# EAGLE design version1 (EAGLE 5.11)
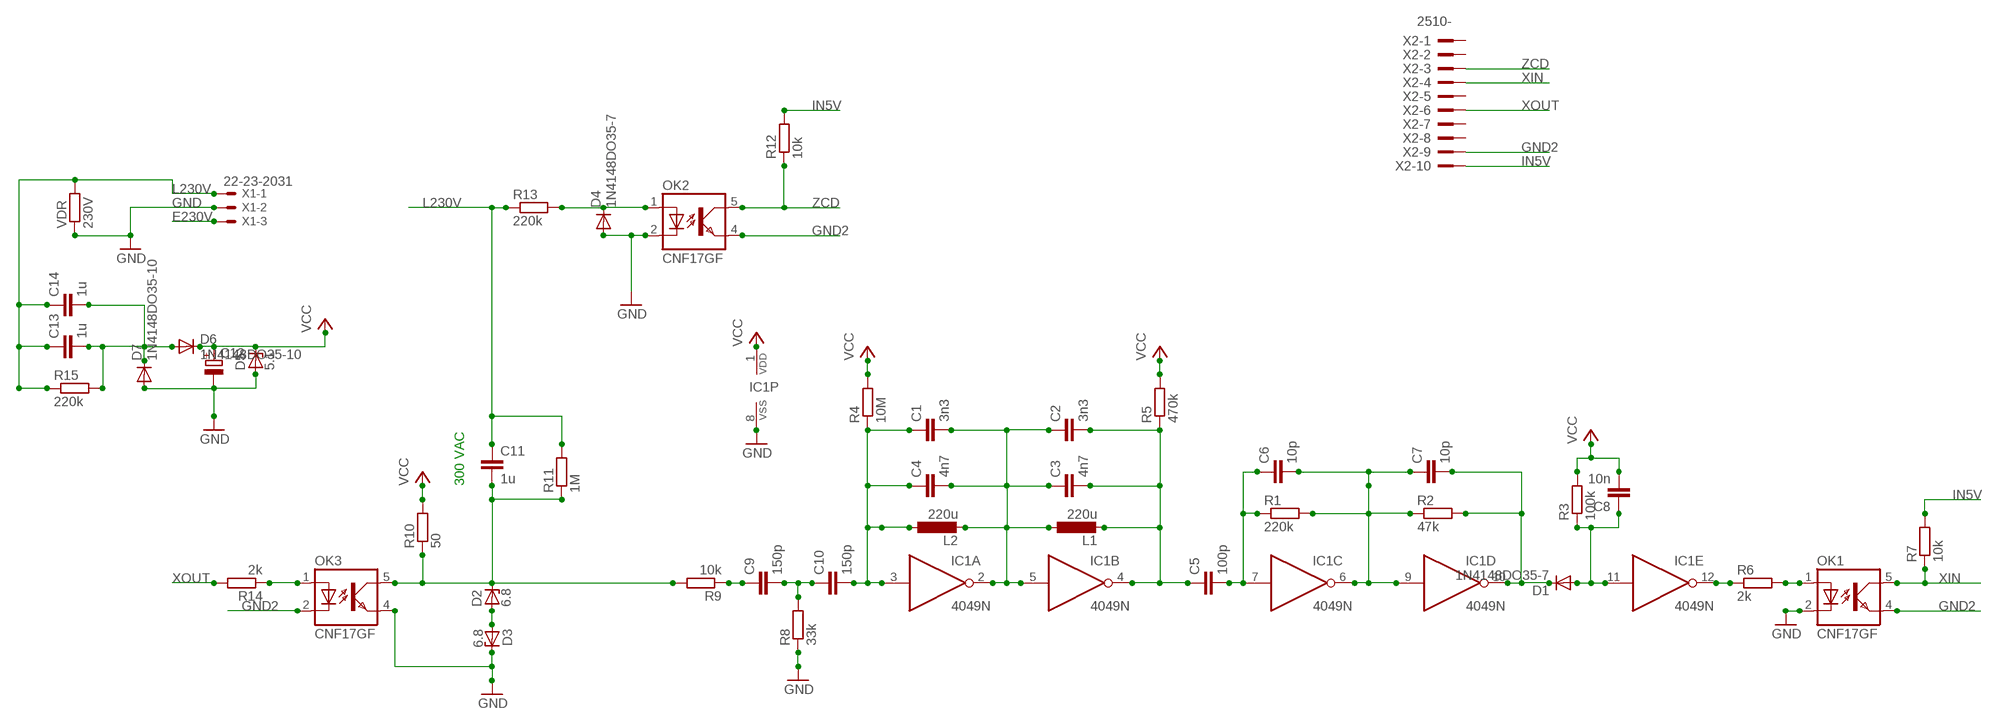
[diagram p0: schematic, sheet 1]

## Parts
C1  3n3  C-EU025_050-025X075  [C025_050-025X075]
C2  3n3  C-EU025_050-025X075  [C025_050-025X075]
C3  4n7  C-EU025_050-025X075  [C025_050-025X075]
C4  4n7  C-EU025_050-025X075  [C025_050-025X075]
C5  100p  C-EU025_050-025X075  [C025_050-025X075]
C6  10p  C-EU025_050-025X075  [C025_050-025X075]
C7  10p  C-EU025_050-025X075  [C025_050-025X075]
C8  10n  C-EU025_050-025X075  [C025_050-025X075]
C9  150p  C-EU025_050-025X075  [C025_050-025X075]
C10  150p  C-EU025_050-025X075  [C025_050-025X075]
C11  1u  C-EU102-054X133  [C102-054X133]
C12  CPOL-EUE3.5-10  [E3,5-10]
C13  1u  C-EU102-054X133  [C102-054X133]
C14  1u  C-EU102-054X133  [C102-054X133]
D1  1N4148DO35-7  [DO35-7]
D2  6.8  ZENER-DIODEZD-10  [ZDIO-10]
D3  6.8  ZENER-DIODEZD-10  [ZDIO-10]
D4  1N4148DO35-7  [DO35-7]
D5  5.1  ZENER-DIODEZD-10  [ZDIO-10]
D6  1N4148DO35-10  [DO35-10]
D7  1N4148DO35-10  [DO35-10]
IC1  4049N  [DIL16]
L1  220u  L-EU0207/10  [0207/10]
L2  220u  L-EU0207/10  [0207/10]
OK1  CNF17GF  [DIL06B]
OK2  CNF17GF  [DIL06B]
OK3  CNF17GF  [DIL06B]
R1  220k  R-EU_0207/10  [0207/10]
R2  47k  R-EU_0207/10  [0207/10]
R3  100k  R-EU_0207/10  [0207/10]
R4  10M  R-EU_0207/10  [0207/10]
R5  470k  R-EU_0207/10  [0207/10]
R6  2k  R-EU_0207/10  [0207/10]
R7  10k  R-EU_0207/10  [0207/10]
R8  33k  R-EU_0207/10  [0207/10]
R9  10k  R-EU_0207/10  [0207/10]
R10  50  R-EU_0207/10  [0207/10]
R11  1M  R-EU_0207/10  [0207/10]
R12  10k  R-EU_0207/10  [0207/10]
R13  220k  R-EU_0207/10  [0207/10]
R14  2k  R-EU_0207/10  [0207/10]
R15  220k  R-EU_0207/10  [0207/10]
VDR  230V  R-EU_0207/12  [0207/12]
X1  22-23-2031  [22-23-2031]
X2  2510-  [PAK100/2500-10]

## Nets
E230V: X1.3
GND: C12.- D3.C D4.A D5.A D7.A IC1.8(P:VSS) OK1.2(C) OK2.2(C) OK3.4(EMIT) R8.1 VDR.1 X1.2
GND2: OK1.4(EMIT) OK2.4(EMIT) OK3.2(C) X2.9
IN5V: R7.2 R12.2 X2.10
L230V: C11.1 C13.1 C14.1 R11.2 R13.1 R15.1 VDR.2 X1.1
N$1: C1.1 C4.1 C10.2 IC1.3(A:I) L2.1 R4.1
N$2: C5.2 C6.1 IC1.7(C:I) R1.1
N$3: C1.2 C2.1 C3.1 C4.2 IC1.2(A:O) IC1.5(B:I) L1.1 L2.2
N$4: C2.2 C3.2 C5.1 IC1.4(B:O) L1.2 R5.1
N$5: C6.2 C7.1 IC1.6(C:O) IC1.9(D:I) R1.2 R2.1
N$6: C7.2 D1.C IC1.10(D:O) R2.2
N$7: C8.1 D1.A IC1.11(E:I) R3.1
N$8: C9.2 C10.1 R8.2
N$9: IC1.12(E:O) R6.1
N$10: OK1.1(A) R6.2
N$11: C9.1 R9.1
N$13: D2.A D3.A
N$14: C11.2 D2.C OK3.5(COL) R9.2 R10.1 R11.1
N$16: D4.C OK2.1(A) R13.2
N$17: C13.2 C14.2 D6.A D7.C R15.2
N$18: OK3.1(A) R14.1
VCC: C8.2 C12.+ D5.C D6.C IC1.1(P:VDD) R3.2 R4.2 R5.2 R10.2
XIN: OK1.5(COL) R7.1 X2.4
XOUT: R14.2 X2.6
ZCD: OK2.5(COL) R12.1 X2.3
Unconnected: IC1.14(F:I) IC1.15(F:O) X2.1 X2.2 X2.5 X2.7 X2.8

## Notes on the sheet
- 300 VAC

## Library data of the parts
C1-C11 C13 C14 = rcl:C-EU: CAPACITOR, European symbol
C12 = rcl:CPOL-EU: POLARIZED CAPACITOR, European symbol
D1 D4 D6 D7 = diode:1N4148: DIODE high speed (Philips)
D2 D3 D5 = diode:ZENER-DIODE: Z-Diode
IC1 = 40xx:4049: Hex inverting BUFFER
L1 L2 = rcl:L-EU: INDUCTOR, European symbol
OK1-OK3 = optocoupler:CNF17GF: HEWLETT PACKARD OPTO COUPLER; OC_FARNELL: unknown; OC_NEWARK: unknown
R1-R15 VDR = rcl:R-EU_: RESISTOR, European symbol
X1 = con-molex:22-23-2031: .100" (2.54mm) Center Header - 3 Pin; MF: MOLEX; MPN: 22-23-2031; OC_FARNELL: 1462950; OC_NEWARK: 30C0862
X2 = con-3m:2510-: 3M (TM) Pak 100 4-Wall Header Source: 3M; MF: 3M; MPN: 2510-6002UB; OC_FARNELL: 9838244; OC_NEWARK: 46F4725

## Board
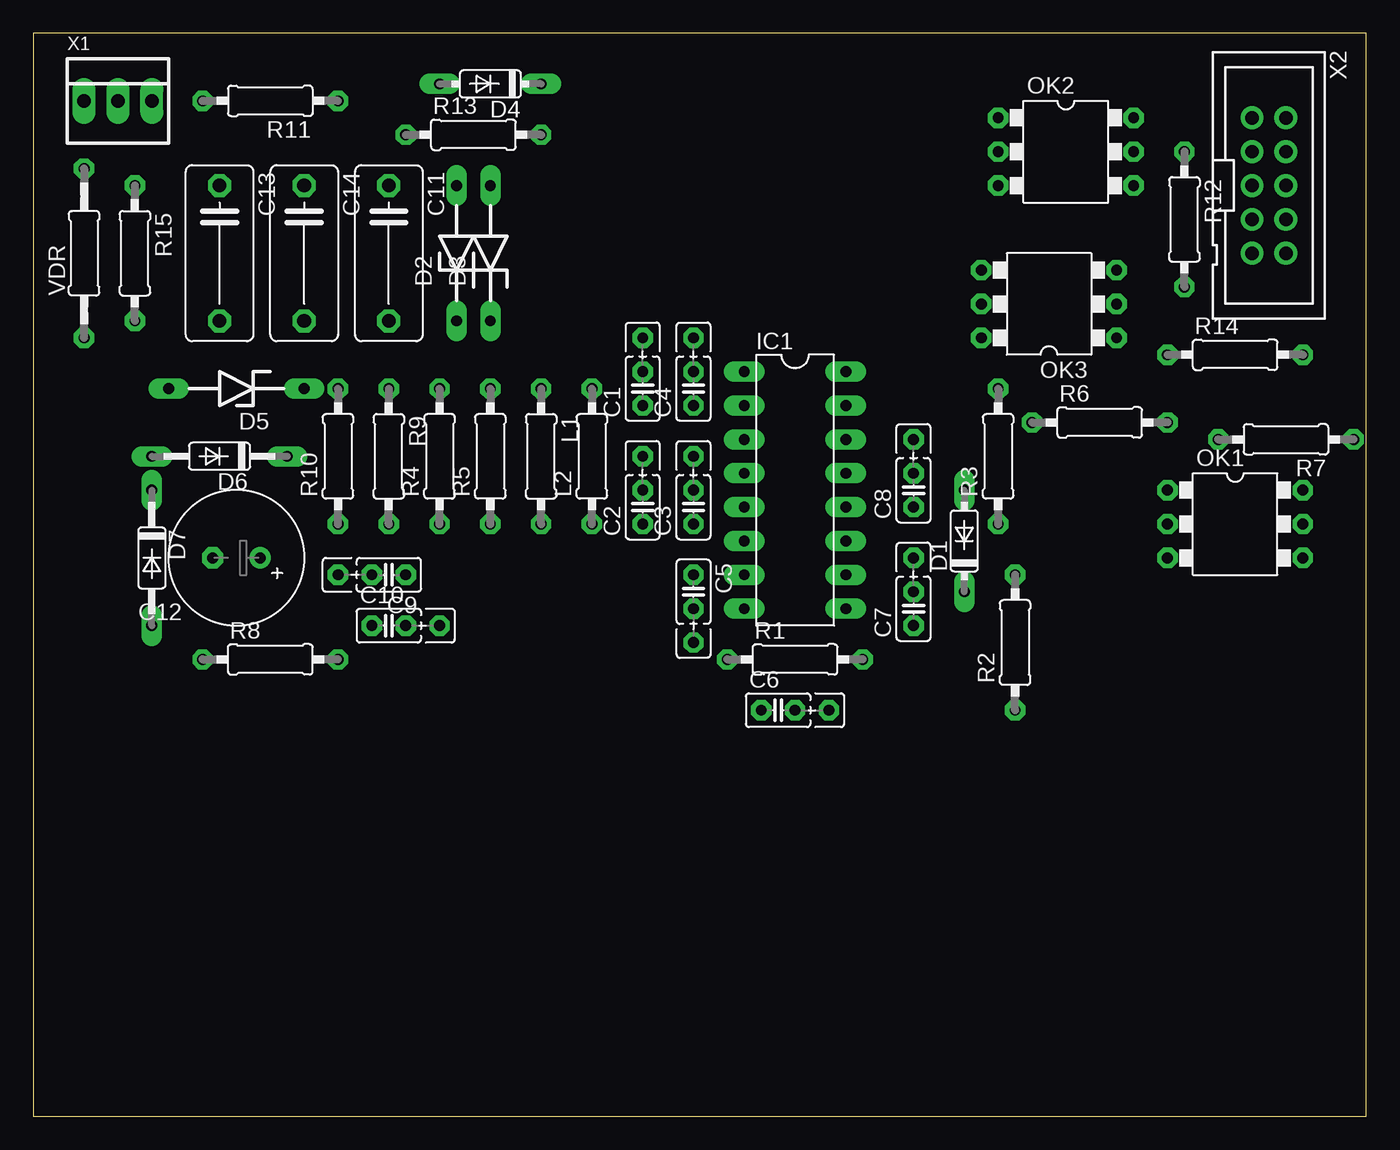
[diagram p1: board, top side]
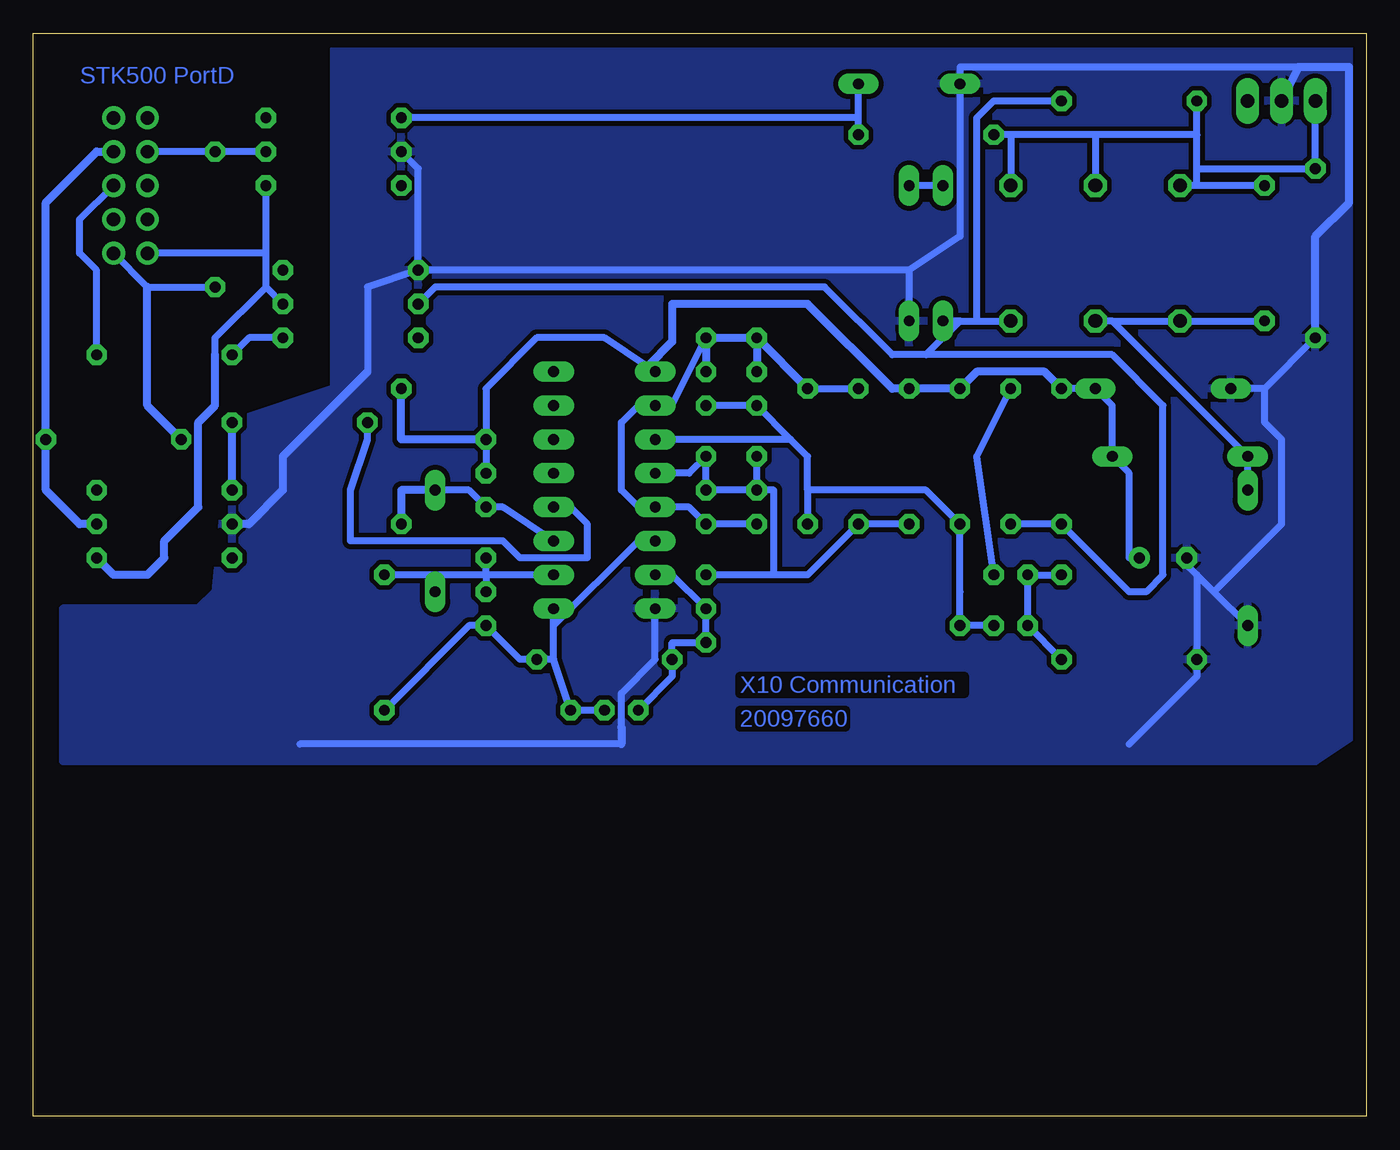
[diagram p2: board, bottom side, seen from below]

Size 100 x 81.27 mm. Coordinates in mm from the lower left corner, seen from the top.
Outline: 0,0 100,0 100,81.27 0,81.27 0,0
Copper layers (1*16): Top 0.035mm / dielectric 1.5mm / Bottom 0.035mm
Design rules "default *": minimum track width 20mil, minimum drill 24mil, track to track 14mil, track to pad 10mil, pad to pad 10mil, via to via 8mil, smd to smd 8mil, copper to edge 40mil, drill to drill 12mil, minimum pad ring 14mil, minimum via ring 8mil, stop-mask expansion 4mil, vias tented up to drill 0mil, thermal gap 10mil

### Footprints (pad centres in the part's own frame; a part is rotated, then mirrored left to right if it is on the bottom)
C025_050-025X075 = drill 0.813 octagon: 1 -1.27,0; 2 1.27,0; 3 3.81,0
C102-054X133 = drill 1.016 octagon: 1 -5.08,0; 2 5.08,0
E3,5-10 = drill 0.813 pad 1.6 round: + -1.778,0 | drill 0.813 pad 1.6 octagon: - 1.778,0
DO35-7 = drill 0.813 long: A 3.81,0; C -3.81,0
ZDIO-10 = drill 0.813 long: A 5.08,0; C -5.08,0
DO35-10 = drill 0.813 long: A 5.08,0; C -5.08,0
DIL16 = drill 0.813 long: 1 -8.89,-3.81; 2 -6.35,-3.81; 3 -3.81,-3.81; 4 -1.27,-3.81; 5 1.27,-3.81; 6 3.81,-3.81; 7 6.35,-3.81; 8 8.89,-3.81; 9 8.89,3.81; 10 6.35,3.81; 11 3.81,3.81; 12 1.27,3.81; 13 -1.27,3.81; 14 -3.81,3.81; 15 -6.35,3.81; 16 -8.89,3.81
0207/10 = drill 0.813 octagon: 1 -5.08,0; 2 5.08,0
DIL06B = drill 0.813 octagon: 1 -2.54,-5.08; 2 0,-5.08; 3 2.54,-5.08; 4 2.54,5.08; 5 0,5.08; 6 -2.54,5.08
0207/12 = drill 0.813 octagon: 1 -6.35,0; 2 6.35,0
22-23-2031 = drill 1 long: 1 -2.54,0; 2 0,0; 3 2.54,0
PAK100/2500-10 = drill 1 pad 1.422 round: 1 -5.08,-1.27; 2 -5.08,1.27; 3 -2.54,-1.27; 4 -2.54,1.27; 5 0,-1.27; 6 0,1.27; 7 2.54,-1.27; 8 2.54,1.27; 9 5.08,-1.27; 10 5.08,1.27

### Placement (x,y rotation side)
C1  45.72,54.61 90 top
C2  45.72,45.72 90 top
C3  49.53,45.72 90 top
C4  49.53,54.61 90 top
C5  49.53,39.37 270 top
C6  55.88,30.48 0 top
C7  66.04,38.1 90 top
C8  66.04,46.99 90 top
C9  26.67,40.64 180 top
C10  26.67,36.83 0 top
C11  26.67,64.77 270 top
C12  15.24,41.91 180 top
C13  13.97,64.77 270 top
C14  20.32,64.77 270 top
D1  69.85,43.18 90 top
D2  31.75,64.77 90 top
D3  34.29,64.77 90 top
D4  34.29,77.47 180 top
D5  15.24,54.61 180 top
D6  13.97,49.53 180 top
D7  8.89,41.91 270 top
IC1  57.15,46.99 270 top
L1  38.1,49.53 270 top
L2  41.91,49.53 90 top
OK1  90.17,44.45 270 top
OK2  77.47,72.39 270 top
OK3  76.2,60.96 90 top
R1  57.15,34.29 0 top
R2  73.66,35.56 90 top
R3  72.39,49.53 90 top
R4  30.48,49.53 90 top
R5  34.29,49.53 90 top
R6  80.01,52.07 0 top
R7  93.98,50.8 180 top
R8  17.78,34.29 0 top
R9  26.67,49.53 270 top
R10  22.86,49.53 90 top
R11  17.78,76.2 180 top
R12  86.36,67.31 270 top
R13  33.02,73.66 0 top
R14  90.17,57.15 0 top
R15  7.62,64.77 270 top
VDR  3.81,64.77 90 top
X1  6.35,76.2 0 top
X2  92.71,69.85 270 top

### Tracks (layer width: path | path; a pad name or v marks a point on that pad's centre or on a via)
GND
  Bottom 0.508: 7.62,54.61 D5.A | 7.62,54.61 VDR.1 | 12.7,40.64 13.97,41.91 C12.- | 11.43,39.37 12.7,40.64 | D7.A 11.43,39.37 | 12.7,40.64 R8.1 12.7,33.02 17.78,27.94 | IC1.8 53.34,34.29 55.88,31.75 55.88,29.21 | 7.62,54.61 7.62,52.07 6.35,50.8 6.35,44.45 11.43,39.37 | OK3.4 71.12,71.12 OK2.2 | 74.93,55.88 74.93,62.23 OK3.4 | 34.29,63.5 D3.C | 34.29,63.5 30.48,66.04 D4.A 30.48,78.74 5.08,78.74 | 34.29,63.5 OK3.4 | 55.88,27.94 80.01,27.94
  Bottom 0.61: 55.88,29.21 55.88,27.94 | 74.93,55.88 81.28,49.53 81.28,46.99 83.82,44.45 OK1.2 | VDR.1 3.81,66.04 1.27,68.58 1.27,78.74 5.08,78.74 X1.2
  pour Bottom: 0,80.01 77.47,80.01 77.47,54.61 85.09,52.07 86.36,39.37 87.63,38.1 97.79,38.1 97.79,26.67 3.81,26.67 0,29.21
GND2
  Bottom 0.508: 82.55,62.23 OK3.2 | 82.55,64.77 OK2.4 | 82.55,62.23 82.55,64.77 | 86.36,57.15 86.36,58.42 82.55,62.23 | 82.55,64.77 X2.9
  Bottom 0.61: 86.36,57.15 86.36,53.34 87.63,52.07 87.63,45.72 90.17,43.18 90.17,41.91 91.44,40.64 93.98,40.64 OK1.4
IN5V
  Bottom 0.508: R12.2 91.44,62.23 X2.10
  Bottom 0.61: R7.2 91.44,53.34 91.44,62.23
L230V
  Bottom 0.508: X1.1 VDR.2 12.7,71.12 | 12.7,69.85 C13.1 | R15.1 12.7,69.85 | 12.7,69.85 12.7,71.12 | 12.7,71.12 12.7,73.66 | 12.7,73.66 R11.2 | 12.7,73.66 20.32,73.66 | 20.32,73.66 26.67,73.66 | 26.67,73.66 R13.1 | 20.32,73.66 C14.1 | 26.67,73.66 C11.1
N$1
  Bottom 0.508: C10.2 30.48,36.83 30.48,39.37 R4.1 33.02,46.99 41.91,46.99 | 41.91,46.99 41.91,49.53 43.18,50.8 | 41.91,46.99 L2.1 | 43.18,50.8 C1.1 C4.1 | 43.18,50.8 IC1.3
N$2
  Bottom 0.508: C6.1 52.07,33.02 R1.1 52.07,35.56 49.53,35.56 C5.2 52.07,40.64 IC1.7
N$3
  Bottom 0.508: C2.1 C3.1 50.8,45.72 IC1.5 54.61,45.72 55.88,46.99 55.88,52.07 54.61,53.34 IC1.2 52.07,53.34 49.53,58.42 | L2.2 L1.1
  Bottom 0.61: 45.72,58.42 49.53,58.42 C4.2 | 45.72,58.42 L2.2 | 45.72,58.42 C1.2
N$4
  Bottom 0.508: C2.2 C3.2 49.53,49.53 50.8,48.26 IC1.4 | R5.1 L1.2 41.91,40.64 44.45,40.64 | 44.45,40.64 C5.1 | C2.2 44.45,46.99 44.45,40.64 | C2.2 45.72,49.53 C2.2
N$5
  Bottom 0.508: C6.2 59.69,30.48 60.96,34.29 | 60.96,34.29 R1.2 63.5,34.29 C7.1 67.31,36.83 R2.1 | 60.96,34.29 60.96,36.83 | 60.96,36.83 IC1.9 | IC1.6 54.61,43.18 60.96,36.83
N$6
  Bottom 0.508: 69.85,40.64 R2.2 | 66.04,40.64 66.04,41.91 66.04,40.64 | 66.04,40.64 69.85,40.64 | IC1.10 66.04,40.64 | 66.04,40.64 C7.2 | 69.85,40.64 D1.C
N$7
  Bottom 0.508: IC1.11 64.77,45.72 C8.1 67.31,46.99 D1.A
  Bottom 0.61: D1.A 72.39,46.99 R3.1
N$8
  Bottom 0.508: R8.2 C10.1 C9.2 22.86,40.64
N$9
  Bottom 0.508: IC1.12 59.69,45.72 58.42,44.45 58.42,41.91 63.5,41.91 64.77,43.18 76.2,43.18 76.2,46.99 74.93,50.8 R6.1
N$10
  Bottom 0.61: OK1.1 R6.2
N$11
  Bottom 0.508: C9.1 29.21,49.53 R9.1
N$13
  Bottom 0.508: D2.A D3.A
N$14
  Bottom 0.508: R9.2 R10.1 17.78,39.37 16.51,39.37 15.24,40.64 15.24,53.34 19.05,57.15 33.02,57.15 | 29.21,59.69 C11.2 | 30.48,59.69 29.21,59.69 | 30.48,59.69 D2.C | R11.1 27.94,76.2 29.21,74.93 29.21,59.69 | OK3.5 69.85,62.23 40.64,62.23 35.56,57.15 33.02,57.15 | 33.02,57.15 30.48,59.69
N$16
  Bottom 0.508: 38.1,74.93 D4.C | R13.2 38.1,74.93 | 38.1,74.93 OK2.1
N$17
  Bottom 0.508: D7.C D6.A 19.05,59.69 | R15.2 C13.2 19.05,59.69 | 19.05,59.69 C14.2
N$18
  Bottom 0.508: OK3.1 83.82,58.42 R14.1
VCC
  Bottom 0.508: R10.2 D5.C 19.05,53.34 D6.C 17.78,48.26 17.78,41.91 C12.+ | 66.04,50.8 66.04,54.61 62.23,58.42 57.15,58.42 53.93,56.27 IC1.1 | 66.04,50.8 C8.2 | 66.04,50.8 71.12,50.8
  Bottom 0.61: R3.2 72.39,50.8 66.04,50.8 | R10.2 24.13,55.88 29.21,55.88 R4.2 R5.2 35.56,54.61 41.91,60.96 52.07,60.96 52.07,58.13 53.93,56.27
XIN
  Bottom 0.61: OK1.5 96.52,44.45 99.06,46.99 R7.1 99.06,68.58 95.25,72.39 X2.4
XOUT
  Bottom 0.508: R14.2 95.25,63.5 96.52,64.77 96.52,67.31 X2.6
ZCD
  Bottom 0.508: OK2.5 R12.1 X2.3

### Text on the board
Bottom: STK500 PortD | X10 Communication | 20097660